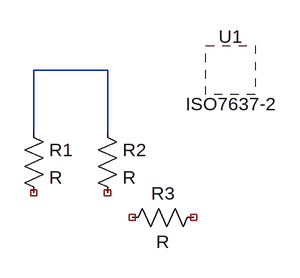
[diagram p0: schematic Draft1.asc]
Draft1.asc, the LTspice schematic file:
Version 4
SHEET 1 880 680
WIRE 224 0 128 0
WIRE 128 80 128 0
WIRE 224 80 224 0
SYMBOL res 112 64 R0
SYMATTR InstName R1
SYMBOL res 208 64 R0
SYMATTR InstName R2
SYMBOL res 352 176 R90
WINDOW 0 0 56 VBottom 2
WINDOW 3 32 56 VTop 2
SYMATTR InstName R3
SYMBOL ISO7637-2 384 0 R0
SYMATTR InstName U1

The netlist it stands for:
* Draft1.asc
R1 N001 NC_01 R
R2 N001 NC_02 R
R3 NC_03 NC_04 R
* U1: ISO7637-2 (symbol ISO7637-2 not available, pin order unknown); nets seen at it: 
.backanno
.end